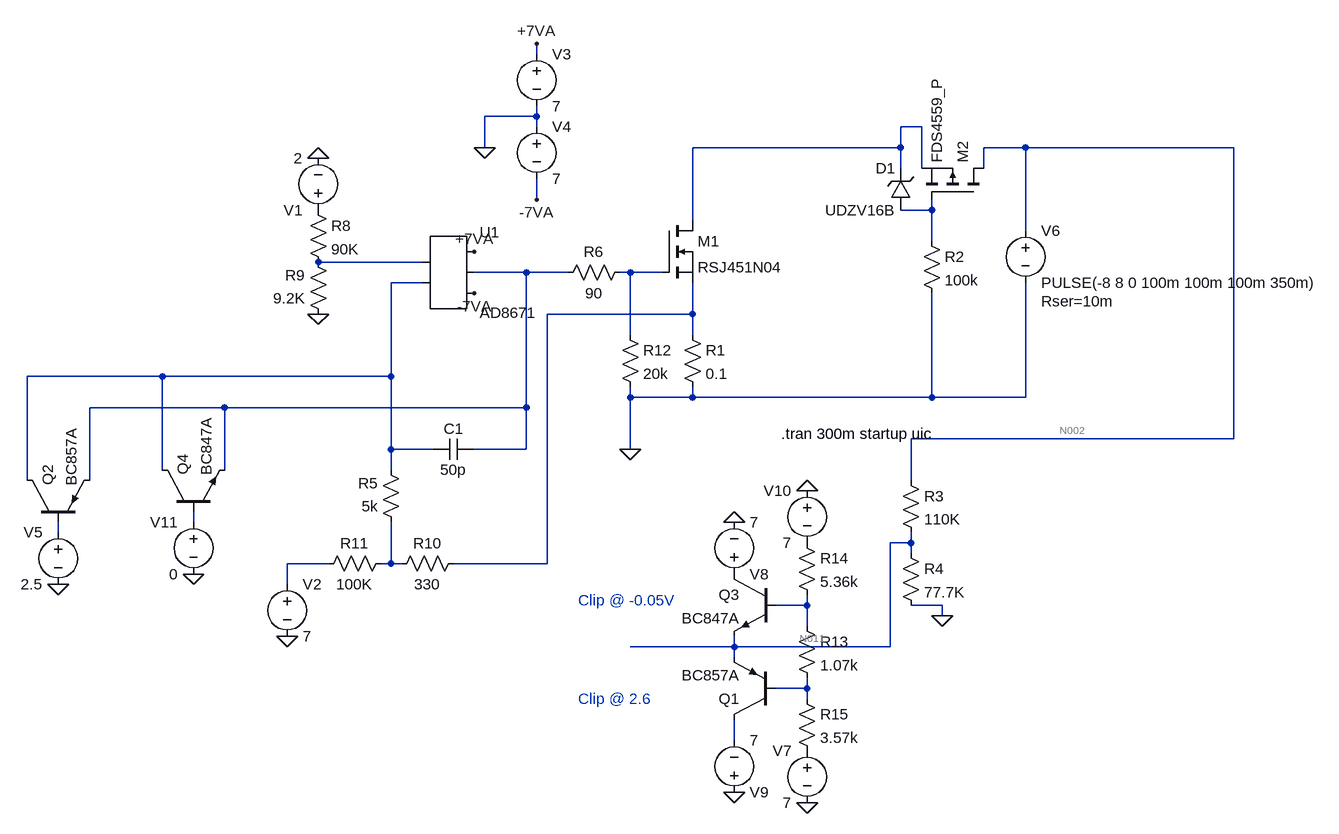
[diagram p0: schematic SIM_WITH_LOAD.asc]
* SIM_WITH_LOAD.asc
M1 N001 N006 N008 N008 RSJ451N04
R1 N008 0 0.1
V3 +7VA 0 7
V4 0 -7VA 7
D1 N003 N001 UDZV16B
R2 N003 0 100k
M2 N002 N003 N001 N001 FDS4559_P
R3 N002 N011 110K
R4 N011 0 77.7K
Q1 N016 N015 N011 0 BC857A
Q3 P001 N014 N011 0 BC847A
V8 P001 0 7
V6 N002 0 PULSE(-8 8 0 100m 100m 100m 350m) Rser=10m
R6 N006 N005 90
C1 N005 N007 50p
V1 P002 0 2
R8 P002 N004 90K
R9 0 N004 9.2K
V2 N012 0 7
R10 N008 N013 330
R11 N013 N012 100K
R12 N006 0 20k
* U1: AD8671 (symbol AutoGenerated\AD8671 not available, pins judged from their places): pin1=N004 pin2=N007 pin3=+7VA pin4=N005 pin5=-7VA
R5 N013 N007 5k
Q2 N007 N010 N005 0 BC857A
V5 N010 0 2.5
Q4 N007 N009 N005 0 BC847A
V11 N009 0 0
R13 N014 N015 1.07k
R14 P003 N014 5.36k
R15 N015 P004 3.57k
V7 P004 0 7
V9 0 N016 7
V10 0 P003 7
.model D D
.lib standard.dio
.model NPN NPN
.model PNP PNP
.lib standard.bjt
.model NMOS NMOS
.model PMOS PMOS
.lib standard.mos
.tran 300m startup uic
* Clip @ -0.05V
* Clip @ 2.6
.backanno
.end

* Results of the author's LTspice run, read from the files saved beside the schematic
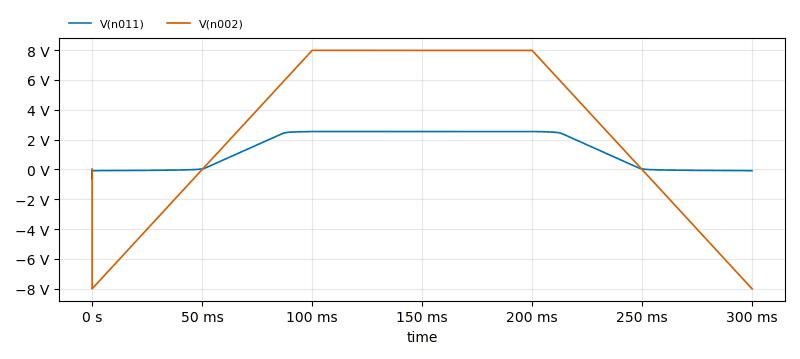
[diagram p1: Transient Analysis of SIM_WITH_LOAD.asc, plotted from the saved traces]
* Transient Analysis, 1 run:
*   V(n011): min -658.5 mV, max 2.543 V, average 1.349 V, rms 1.788 V, last -79.17 mV
*   V(n002): min -8 V, max 7.984 V, average 2.656 V, rms 5.963 V, last -8 V